# Altium schematic sheet 2_AASTM32-MCU.SchDoc
size A4; SheetNumber: 3; SheetTotal: 4
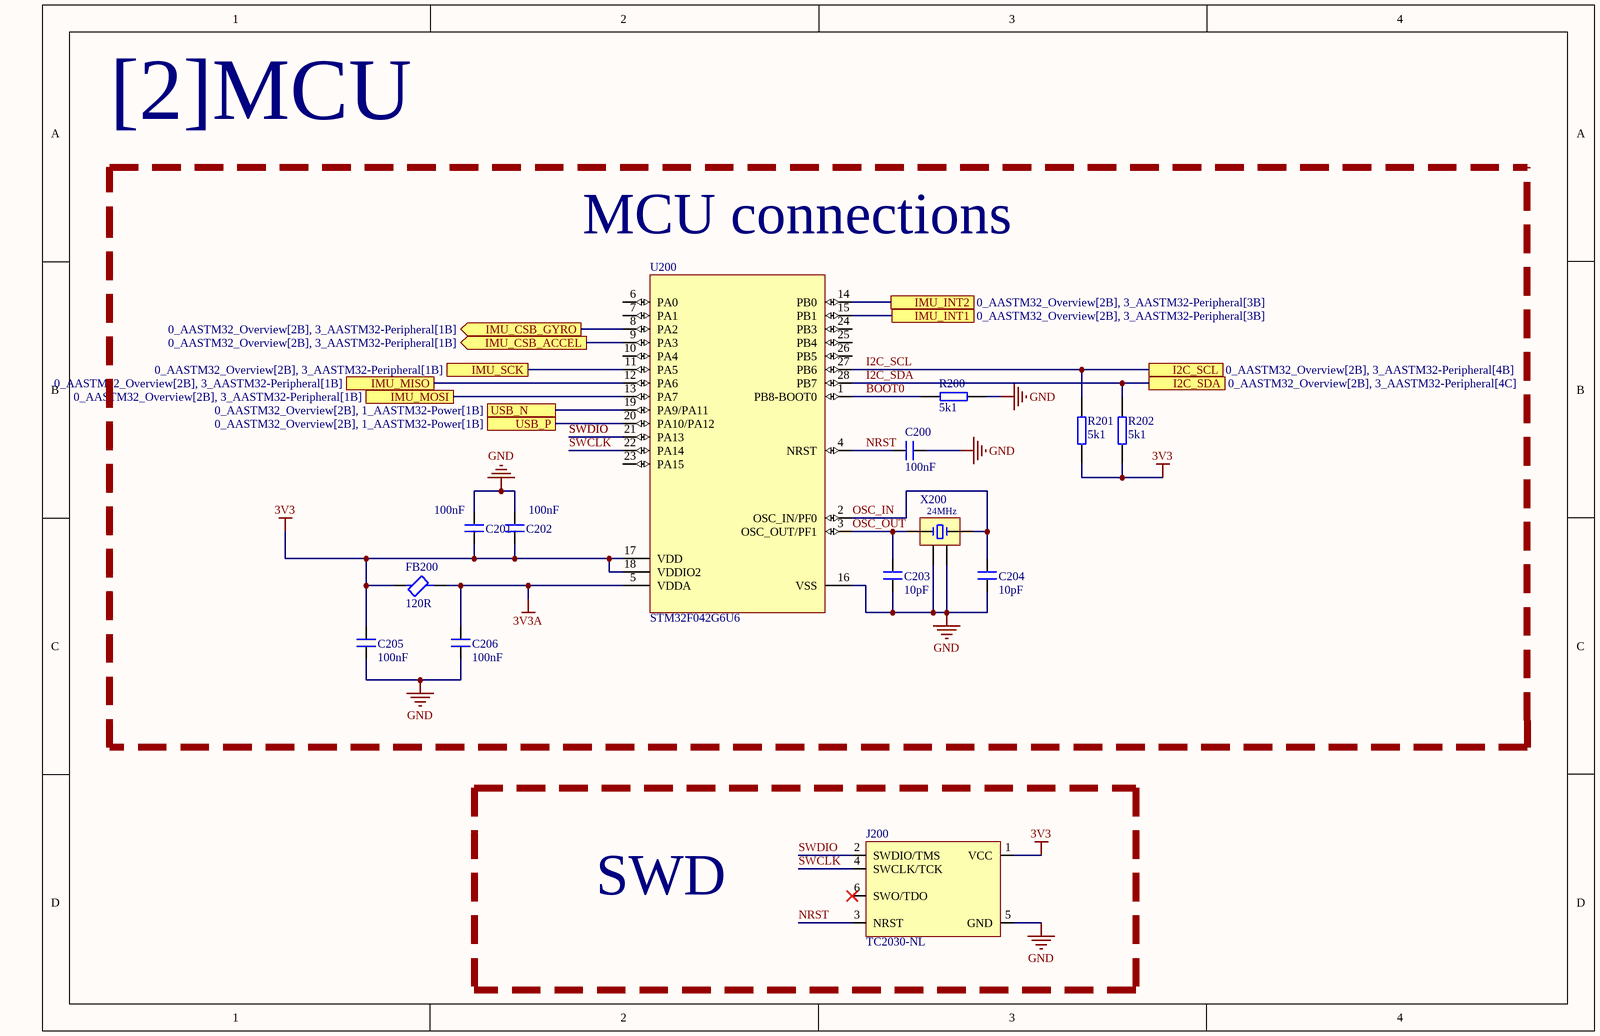
[diagram p0: 2_AASTM32-MCU.SchDoc]

## Parts
C200  100nF  [0603 CAP]
C201  100nF  [0603 CAP]
C202  100nF  [0603 CAP]
C203  10pF  [0603 CAP]
C204  10pF  [0603 CAP]
C205  100nF  [0603 CAP]
C206  100nF  [0603 CAP]
FB200  120R  [0402 RES]
J200  TC2030-NL  [TC2030-NL-FP]  (no BOM)
R200  5k1  [0603 RES]
R201  5k1  [0603 RES]
R202  5k1  [0603 RES]
U200  STM32F042G6U6  [UFQFPN28]
X200  TSX-3225 24.0000MF15X  [3225]  (value not drawn)

## Blocks framed on the sheet
MCU connections: C200-C206 FB200 R200-R202 U200 X200
SWD: J200

## Ports
I2C_SCL (see 0_AASTM32_Overview[2B], 3_AASTM32-Peripheral[4B]), I2C_SDA (see 0_AASTM32_Overview[2B], 3_AASTM32-Peripheral[4C]), IMU_CSB_ACCEL (out, see 0_AASTM32_Overview[2B], 3_AASTM32-Peripheral[1B]), IMU_CSB_GYRO (out, see 0_AASTM32_Overview[2B], 3_AASTM32-Peripheral[1B]), IMU_INT1 (see 0_AASTM32_Overview[2B], 3_AASTM32-Peripheral[3B]), IMU_INT2 (see 0_AASTM32_Overview[2B], 3_AASTM32-Peripheral[3B]), IMU_MISO (see 0_AASTM32_Overview[2B], 3_AASTM32-Peripheral[1B]), IMU_MOSI (see 0_AASTM32_Overview[2B], 3_AASTM32-Peripheral[1B]), IMU_SCK (see 0_AASTM32_Overview[2B], 3_AASTM32-Peripheral[1B]), USB_N (see 0_AASTM32_Overview[2B], 1_AASTM32-Power[1B]), USB_P (see 0_AASTM32_Overview[2B], 1_AASTM32-Power[1B])

## Nets
3V3: C201.2 C202.2 C205.2 FB200.1 J200.1(VCC) R201.2 R202.2 U200.17(VDD) U200.18(VDDIO2)
3V3A: C206.2 FB200.2 U200.5(VDDA)
GND: C200.1 C201.1 C202.1 C203.1 C204.1 C205.1 C206.1 J200.5(GND) R200.1 U200.16(VSS) X200.2 X200.4
BOOT0: R200.2 U200.1(PB8-BOOT0)
I2C_SCL: R201.1 U200.27(PB6) ; port I2C_SCL
I2C_SDA: R202.1 U200.28(PB7) ; port I2C_SDA
IMU_CSB_ACCEL: U200.9(PA3) ; port IMU_CSB_ACCEL
IMU_CSB_GYRO: U200.8(PA2) ; port IMU_CSB_GYRO
IMU_INT1: U200.15(PB1) ; port IMU_INT1
IMU_INT2: U200.14(PB0) ; port IMU_INT2
IMU_MISO: U200.12(PA6) ; port IMU_MISO
IMU_MOSI: U200.13(PA7) ; port IMU_MOSI
IMU_SCK: U200.11(PA5) ; port IMU_SCK
NRST: C200.2 J200.3(NRST) U200.4(NRST)
OSC_IN: C204.2 U200.2(OSC_IN/PF0) X200.3
OSC_OUT: C203.2 U200.3(OSC_OUT/PF1) X200.1
SWCLK: J200.4(SWCLK/TCK) U200.22(PA14)
SWDIO: J200.2(SWDIO/TMS) U200.21(PA13)
USB_N: U200.19(PA9/PA11) ; port USB_N
USB_P: U200.20(PA10/PA12) ; port USB_P

Not connected (* = marked no-connect by the designer): J200 6(SWO/TDO)*; U200 6(PA0) 7(PA1) 10(PA4) 23(PA15) 24(PB3) 25(PB4) 26(PB5)

## Notes on the sheet
- [2]MCU
- (in symbol TSX-3225 24.0000MF15X-AC3) 24MHz

## Library data of the parts
C200-C206 = 0603 4u7 CAP: Ceramic Capacitor, Multilayer, Ceramic, 25V, 10% +Tol, 10% -Tol, X5R, 15% TC, 4.7uF, Surface Mount, 0603; Manufacturer: Samsung; Manufacturer Part Number: CL10A475KA8NQNC; Multilayer: Yes; Case: 0603; Supplier: Digikey; Supplier Part Number: 1276-1900-1-ND; RoHS: Yes; Category: Ceramic Capacitors; Stock: 1806164; Pricing: 1=0,35, 10=0,226, 50=0,1584, 100=0,1279, 500=0,09502, 1000=0,08314 (USD); Mounting Technology: Surface Mount; Pins: 2; Package Shape: Rectangular; Terminal Finish: Nickel; Dielectric Material: Ceramic; Case/Package: 0603; Min Operating Temperature: -55°C; Max Operating Temperature: 85°C; JESD-609 Code: e3; Package Style: SMTMeter; Value: 4.7uF; Capacitor Type: Ceramic; Tolerance  (fill in as +-): 10%; Packaging: Tape and Reel; Tolerance (fill in as +-): 10%; Rated DC Voltage (URdc): 25V; Temperature Characteristics Code: X5R; Termination: Wraparound; Length: 1.6mm; Width: 0.8mm; Height: 0.95mm; Reach SVHC Compliant: Yes; RoHS Compliant: Yes; ComponentLink1URL: https://datasheet.ciiva.com:443/pdfs/VipMasterIC/IC/SEMS/SEMS-S-A0008384515/SEMS-S-A0008873295-1.pdf?src-supplier=IHS+Markit; ComponentLink1Description: https://datasheet.ciiva.com:443/pdfs/VipMasterIC/IC/SEMS/SEMS-S-A0008384515/SEMS-S-A0008873295-1.pdf?src-supplier=IHS+Markit; ComponentLink2URL: https://datasheet.ciiva.com/25787/cl10a475ka8nqnc-25787017.pdf?src-supplier=Digikey; ComponentLink2Description: https://datasheet.ciiva.com/25787/cl10a475ka8nqnc-25787017.pdf?src-supplier=Digikey
FB200 = Ferritte Bead 120R 0402: Ferrite Chip, 1 Function(s), 0.9A, 2 Pin(s) / BLM15PD121SN1D; Manufacturer: Murata; DC Resistance-Max: 90mR; Clock Frequency: 100MHz; Channels: 1; Current Rating: 900mA; Supplier: Digikey; Supplier Part Number: 490-5203-6-ND; Manufacturer Part Number: BLM15PD121SN1D; RoHS: Yes; Category: Ferrite Beads and Chips; Stock: 709858; Pricing: 1=0,1, 10=0,068, 25=0,0616, 50=0,0556, 100=0,0408, 250=0,02968, 500=0,0272, 1000=0,02348, 5000=0,01854 (USD); Mounting Technology: Surface Mount; Material: Ferrite; Case Code: 0402; Terminal Finish: Nickel; Min Operating Temperature: -55°C; Max Operating Temperature: 125°C; JESD-609 Code: e3; Construction: Chip Bead; Filter Type: FERRITE CHIP; Min Frequency: 100MHz; Output Impedance: 120R; Packaging: Tape and Reel; Length: 1mm; Width: 0.5mm; Height: 0.5mm; Reach SVHC Compliant: Yes; RoHS Compliant: Yes; ComponentLink1URL: https://datasheet.ciiva.com:443/pdfs/VipMasterIC/IC/MURE/MURE-S-A0010009827/MURE-S-A0010009827-1.pdf?src-supplier=IHS+Markit; ComponentLink1Description: https://datasheet.ciiva.com:443/pdfs/VipMasterIC/IC/MURE/MURE-S-A0010009827/MURE-S-A0010009827-1.pdf?src-supplier=IHS+Markit
J200 = TC2030-NL: Tag-Connect No-Solder SWD Debug Connector (No Legs) DO NOT PLACE; Manufacturer: Tag-Connect; Manufacturer Part Number: TC2030-NL-FP
R200-R202 = 0603 10k RES: Case: 0603
U200 = STM32F042G6U6: ARM®-based 32-bit MCU, up to 32 KB Flash, crystal-less USB FS 2.0, CAN, 9 timers, ADC and comm. interfaces, 2.0 - 3.6 V; Manufacturer: STMicroelectronics; Manufacturer Part Number: STM32F042G6U6
X200 = TSX-3225 24.0000MF15X-AC3: Crystals 24MHz 10ppm 9pF-40C +85C